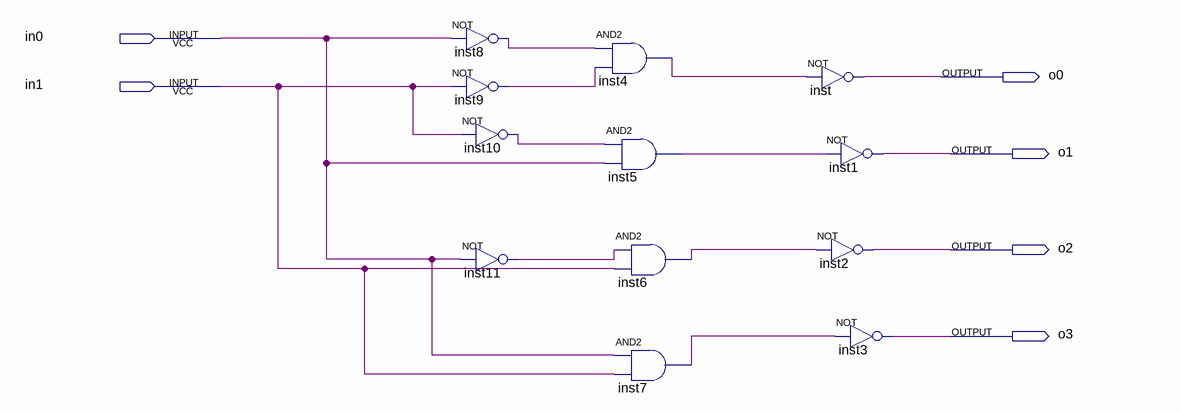
[diagram p0: schematic sheet]
// Quartus schematic decoder2_4low.bdf as structural Verilog: 12 symbols, 6 pins
module decoder2_4low (
  input  in0,
  input  in1,
  output o0,
  output o1,
  output o2,
  output o3
);

  wire inst4_out, inst5_out, inst6_out, inst7_out, inst8_out, inst9_out, inst10_out, inst11_out;

  not inst8 (inst8_out, in0);
  not inst9 (inst9_out, in1);
  not inst10 (inst10_out, in1);
  not inst11 (inst11_out, in0);
  and inst4 (inst4_out, inst8_out, inst9_out);
  and inst5 (inst5_out, inst10_out, in0);
  and inst6 (inst6_out, inst11_out, in1);
  and inst7 (inst7_out, in0, in1);
  not inst (o0, inst4_out);
  not inst1 (o1, inst5_out);
  not inst2 (o2, inst6_out);
  not inst3 (o3, inst7_out);
endmodule
